# Altium project BatteryBoard.PrjPcb
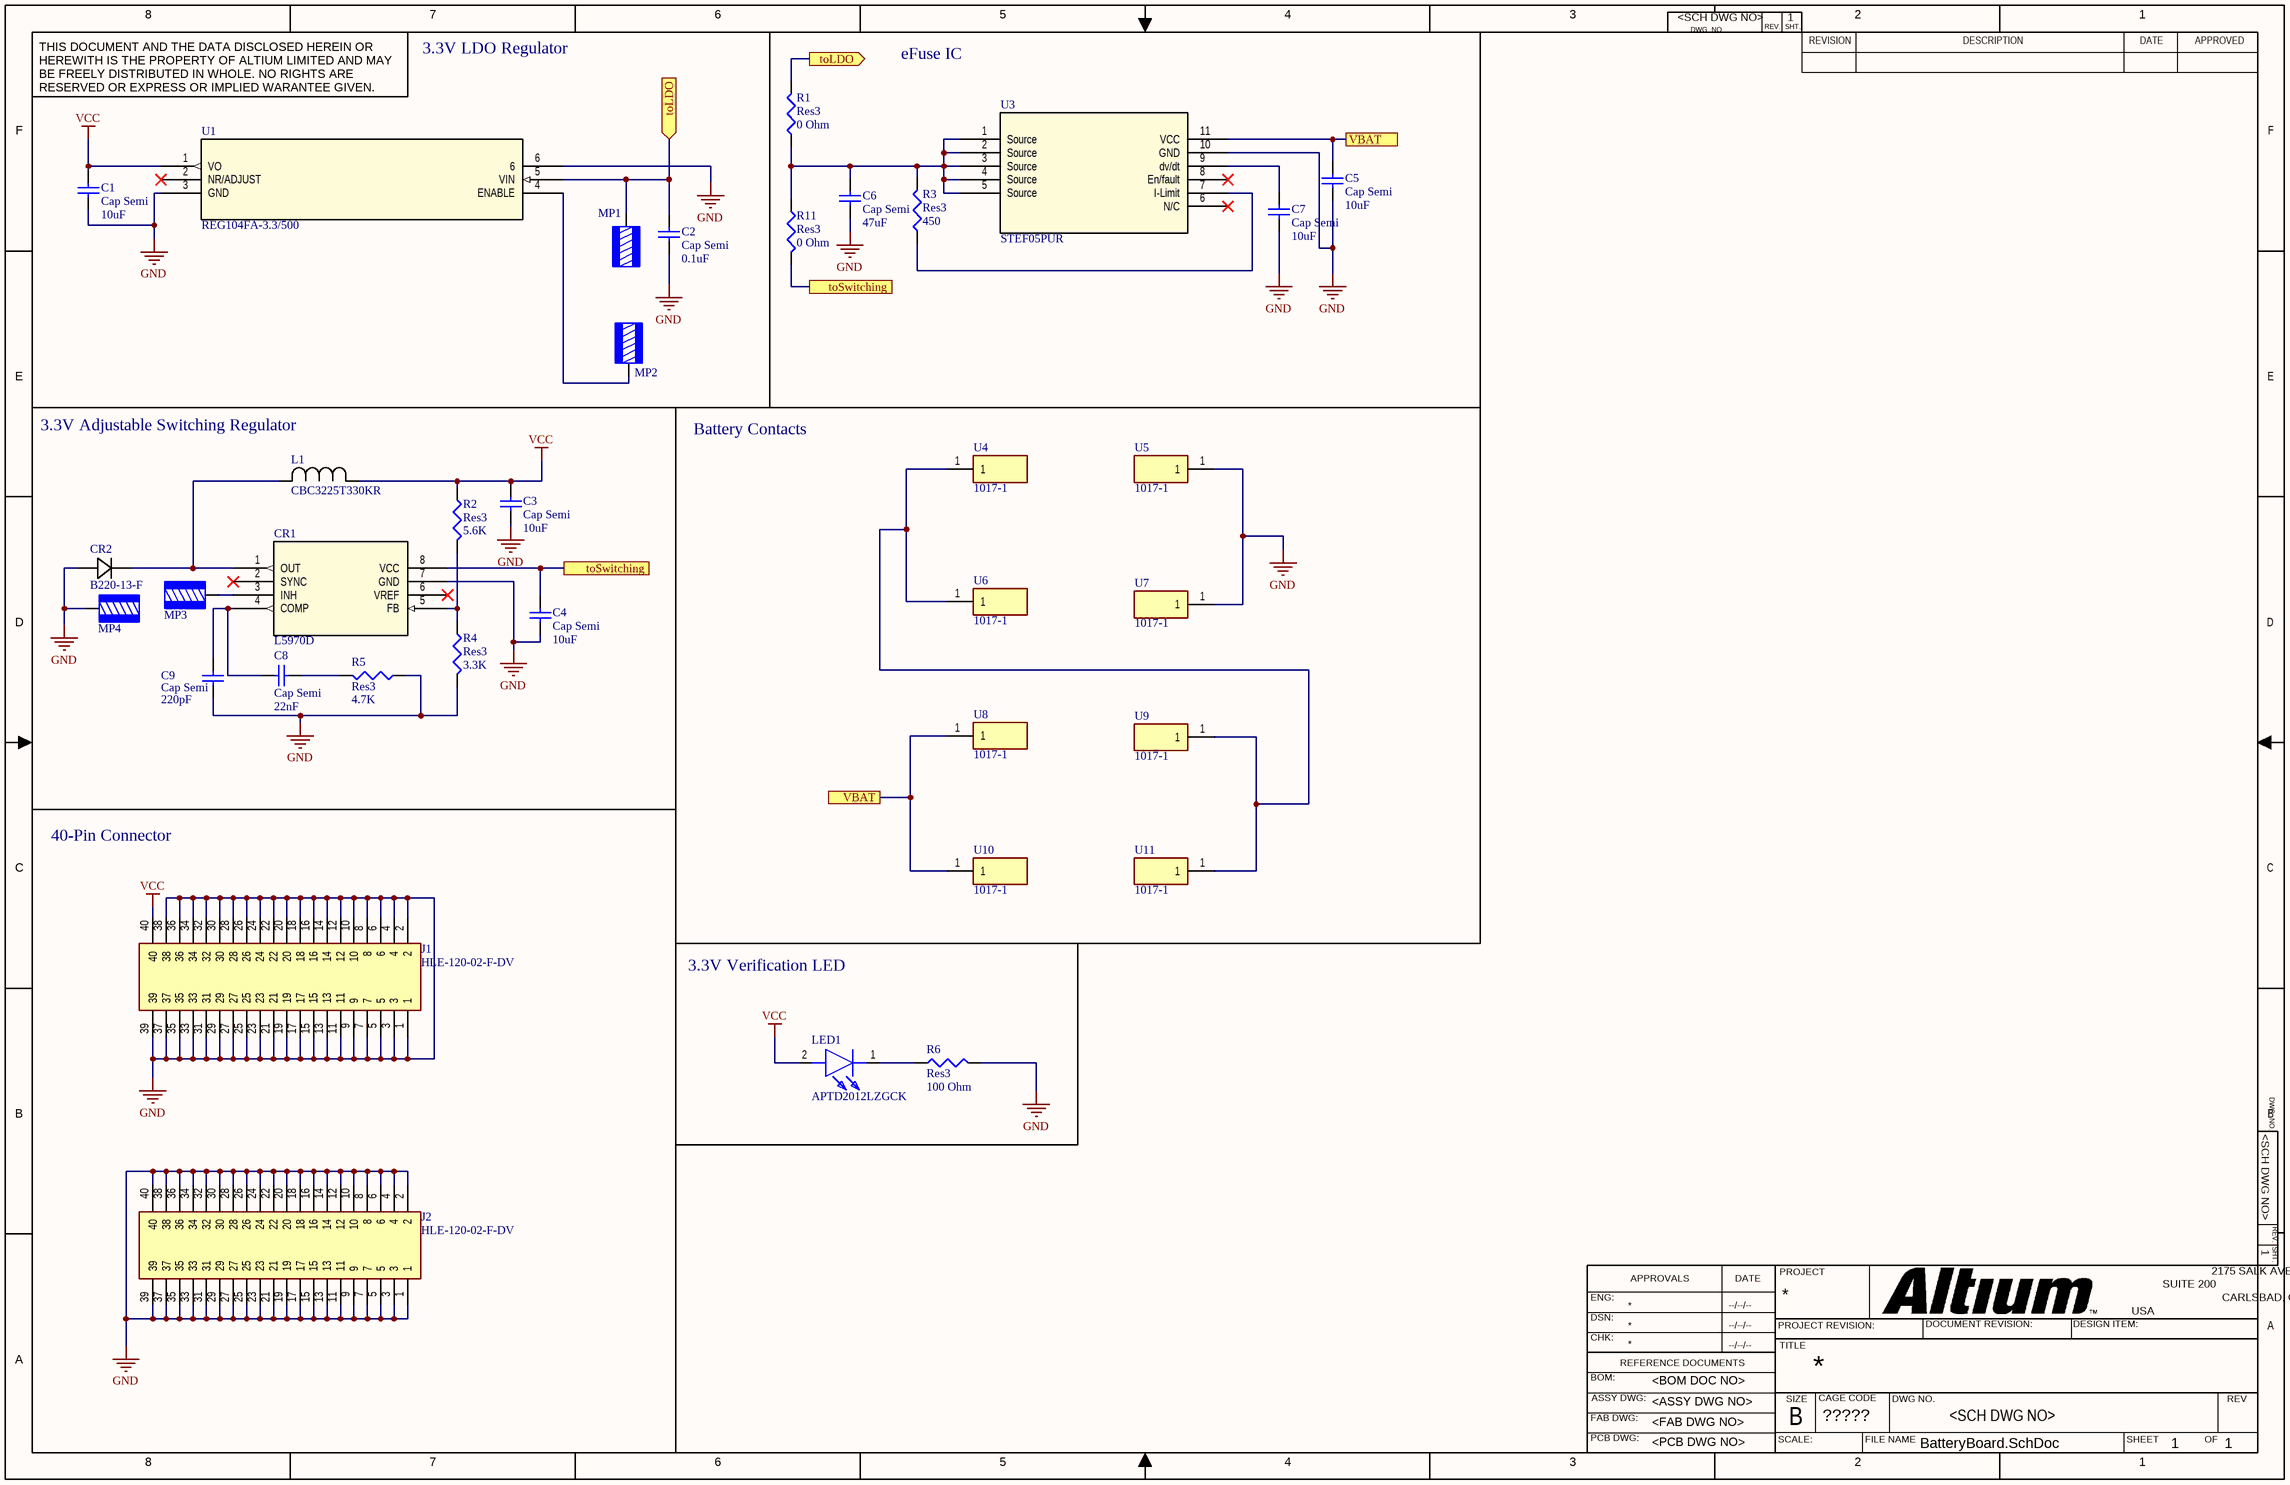
[diagram p0: BatteryBoard.SchDoc]
CAGE_CODE: ?????; CONTRACT_NUMBER: <CONTRACT NO>; DOC_NO_ASSY_DWG: <ASSY DWG NO>; DOC_NO_BOM: <BOM DOC NO>; DOC_NO_FAB_DWG: <FAB DWG NO>; DOC_NO_SCH_DWG: <SCH DWG NO>; PCB_2_DEC_TOL: +/-.01; PCB_3_DEC_TOL: +/-.010; PCB_ANG_TOL: +/-1/2; PCB_ASSEMBLY_NO: <PCB ASSY NO>; PCB_CHECKER: - -----; PCB_CHECKER_APP_DATE: --/--/----; PCB_DESIGNER: - -----; PCB_DESIGNER_APP_DATE: --/--/----; PCB_DWG_NO: <PCB DWG NO>; PCB_ENGINEER: - -----; PCB_ENGINEER_APP_DATE: --/--/----; PCB_PART_NUMBER: <PCB PN>; PCB_REV: A; SCH_REV: A
1 sheet, 36 parts. Net scope: flat (ports and power ports of the same name join across sheets).
Board file: BatteryBoard.PcbDoc

## Sheet BatteryBoard.SchDoc
size 431 x 279 mm; SheetNumber: 1; SheetTotal: 1; ENG_APP_DATE: --/--/--; DSN_APP_DATE: --/--/--; CHK_APP_DATE: --/--/--

### Parts
C1  Cap Semi  value 10uF  [C1206]
C2  Cap Semi  value 0.1uF  [C1206]
C3  Cap Semi  value 10uF  [C1206]
C4  Cap Semi  value 10uF  [C1206]
C5  Cap Semi  value 10uF  [C1206]
C6  Cap Semi  value 47uF  [C1206]
C7  Cap Semi  value 10uF  [C1206]
C8  Cap Semi  value 22nF  [C1206]
C9  Cap Semi  value 220pF  [C1206]
CR1  L5970D  [SO-8_STM-M]
CR2  B220-13-F  [SMB_DIO]
J1  HLE-120-02-F-DV  [SAMTEC_HLE-120-02-F-DV]
J2  HLE-120-02-F-DV  [SAMTEC_HLE-120-02-F-DV]
L1  CBC3225T330KR  [IND_TAIYO_CBC3225_TAY]
LED1  APTD2012LZGCK  [LEDC2012X105N]
MP1  M3  [7466303]  (value not drawn)
MP2  M3  [7466303]  (value not drawn)
MP3  M3  [7466303]  (value not drawn)
MP4  M3  [7466303]  (value not drawn)
R1  Res3  value 0 Ohm  [J1-0603]
R2  Res3  value 5.6K  [J1-0603]
R3  Res3  value 450  [J1-0603]
R4  Res3  value 3.3K  [J1-0603]
R5  Res3  value 4.7K  [J1-0603]
R6  Res3  value 100 Ohm  [J1-0603]
R11  Res3  value 0 Ohm  [J1-0603]
U1  REG104FA-3.3/500  [KTT5_TEX]
U3  STEF05PUR  [DFN_EF05PUR_STM]
U4  1017-1  [10171]
U5  1017-1  [10171]
U6  1017-1  [10171]
U7  1017-1  [10171]
U8  1017-1  [10171]
U9  1017-1  [10171]
U10  1017-1  [10171]
U11  1017-1  [10171]

### Ports
toLDO (in), toLDO (out), toSwitching, VBAT

### Nets
GND: C1.1 C2.1 C3.1 C4.1 C5.2 C6.2 C7.2 C9.1 CR1.7(GND) CR2.2 J1.1 J1.2 J1.3 J1.4 J1.5 J1.6 J1.7 J1.8 J1.9 J1.10 J1.11 J1.12 J1.13 J1.14 J1.15 J1.16 J1.17 J1.18 J1.19 J1.20 J1.21 J1.22 J1.23 J1.24 J1.25 J1.26 J1.27 J1.28 J1.29 J1.30 J1.31 J1.32 J1.33 J1.34 J1.35 J1.36 J1.37 J1.38 J1.39 J2.1 J2.2 J2.3 J2.4 J2.5 J2.6 J2.7 J2.8 J2.9 J2.10 J2.11 J2.12 J2.13 J2.14 J2.15 J2.16 J2.17 J2.18 J2.19 J2.20 J2.21 J2.22 J2.23 J2.24 J2.25 J2.26 J2.27 J2.28 J2.29 J2.30 J2.31 J2.32 J2.33 J2.34 J2.35 J2.36 J2.37 J2.38 J2.39 J2.40 MP4.1 R4.2 R5.1 R6.2 U1.3(GND) U1.6 U3.10(GND) U5.1 U7.1
VCC: C1.2 C3.2 J1.40 L1.1 LED1.2(A) R2.1 U1.1(VO)
NetC2_2: C2.2 MP1.1 R1.2 U1.5(VIN) ; port toLDO
NetC4_2: C4.2 CR1.8(VCC) R11.2 ; port toSwitching
NetC5_1: C5.1 U3.11(VCC) U8.1 U10.1 ; port VBAT
NetC6_1: C6.1 R1.1 R3.2 R11.1 U3.1(Source) U3.2(Source) U3.3(Source) U3.4(Source) U3.5(Source)
NetC7_1: C7.1 U3.9(dv/dt)
NetC8_1: C8.1 R5.2
NetC8_2: C8.2 C9.2 CR1.4(COMP)
NetCR1_1: CR1.1(OUT) CR2.1 L1.2
NetCR1_3: CR1.3(INH) MP3.1
NetCR1_5: CR1.5(FB) R2.2 R4.1
NetLED1_1: LED1.1(K) R6.1
NetMP2_1: MP2.1 U1.4(ENABLE)
NetR3_1: R3.1 U3.7(I-Limit)
NetU4_1: U4.1 U6.1 U9.1 U11.1

Not connected (* = marked no-connect by the designer): CR1 2(SYNC)* 6(VREF)*; U1 2(NR/ADJUST)*; U3 6(N/C)* 8(En/fault)*

### Notes on the sheet
- 3.3V LDO Regulator
- eFuse IC
- (near L1) 3.3V Adjustable Switching Regulator
- Battery Contacts
- 40-Pin Connector
- 3.3V Verification LED
- 8
- 7
- 6
- 5
- 4
- 3
- DWG. NO.
- REV.
- SHT.
- 2
- 1
- THIS DOCUMENT AND THE DATA DISCLOSED HEREIN OR HEREWITH IS THE PROPERTY OF ALTIUM LIMITED AND MAY BE FREELY DISTRIBUTED IN WHOLE. NO RIGHTS ARE RESERVED OR EXPRESS OR IMPLIED WARANTEE GIVEN.
- REVISION
- DESCRIPTION
- DATE
- APPROVED
- F
- E
- D
- C
- B
- ENG:
- APPROVALS
- PROJECT
- SUITE 200
- 2175 SALK AVENUE
- CARLSBAD, CA 92008
- A
- DSN:
- CHK:
- REFERENCE DOCUMENTS
- PROJECT REVISION:
- TITLE
- DOCUMENT REVISION:
- DESIGN ITEM:
- USA
- BOM:
- FAB DWG:
- PCB DWG:
- ASSY DWG:
- SCALE:
- SIZE
- CAGE CODE
- FILE NAME
- DWG NO.
- SHEET
- OF
- REV

### Library data of the parts
C1-C9 = Cap Semi: Capacitor (Semiconductor SIM Model); Published: 8-Jun-2000; LatestRevisionDate: 29-May-2009; LatestRevisionNote: IPC-7351 Footprint Added.; PackageReference: C1206; Publisher: Altium Limited; PackageDescription: Chip Capacitor
CR1 = L5970D: No Description Available; Mfr_Name: STMicroelectronics; Type: DEV; Copyright: Copyright (C) 2022 Ultra Librarian. All rights reserved.; Manufacturer_Part_Number: L5970D; Digi-Key_Part_Number_1: 497-1415-5-ND; RefDes: RefDes
CR2 = B220-13-F: No Description Available; Mfr_Name: Diodes Inc; Type: DEV; Copyright: Copyright (C) 2022 Ultra Librarian. All rights reserved.; Manufacturer_Part_Number: B220-13-F; Digi-Key_Part_Number_1: B220-FDICT-ND; Digi-Key_Part_Number_2: B220-FDIDKR-ND; Digi-Key_Part_Number_3: B220-FDITR-ND; RefDes: RefDes
J1 J2 = HLE-120-02-F-DV: Connector; Manufacturer_Name: SAMTEC; Datasheet Link: http://suddendocs.samtec.com/prints/hle-1xx-02-xxx-dv-xx-xx-xx-mkt.pdf; Manufacturer_Part_Number: HLE-120-02-F-DV; Arrow Part Number: HLE-120-02-F-DV; Arrow Price/Stock: https://www.arrow.com/en/products/hle-120-02-f-dv/samtec
L1 = CBC3225T330KR: No Description Available; Mfr_Name: Taiyo Yuden; Type: DEV; Copyright: Copyright (C) 2022 Ultra Librarian. All rights reserved.; Manufacturer_Part_Number: CBC3225T330KR; Digi-Key_Part_Number_1: 587-3068-1-ND; Digi-Key_Part_Number_2: 587-3068-2-ND; Digi-Key_Part_Number_3: 587-3068-6-ND; RefDes: RefDes
LED1 = APTD2012LZGCK: LED; Manufacturer_Name: Kingbright; Datasheet Link: https://componentsearchengine.com//APTD2012LZGCK.pdf; Height: 1.05mm; Mouser2 Part Number: 604-APTD2012LZGCK; Mouser2 Price/Stock: https://www.mouser.com/Search/Refine.aspx?Keyword=604-APTD2012LZGCK; Manufacturer_Part_Number: APTD2012LZGCK
MP1-MP4 = 7466303: WP-SMRA REDCUBE SMT Right Angled without pins, M3, 50A; Manufacturer: Wurth Elektronik; Surface: Tin; ComponentLink1Description: Website Link; ComponentLink1URL: https://www.we-online.com/redexpert/article/7466303?ad; ComponentLink2Description: Datasheet Link; ComponentLink2URL: https://www.we-online.com/redexpert/spec/7466303?ad; Manufacturer Part Number: 7466303; Category: REDCUBE SMT; Match Code: WP-SMRA; Mount: Surface Mount; Operating Temperature Max: 150°C; Operating Temperature Min: -55°C; Packaging: Bulk; Height: 5mm; Material: Brass; Rated Current: 50A; Thread Size: M3
R1-R6 R11 = Res3: Resistor; Published: 8-Jun-2000; LatestRevisionDate: 29-May-2009; LatestRevisionNote: IPC-7351 Footprint Added.; PackageReference: J1-0603; Publisher: Altium Limited; PackageDescription: Chip Resistor
U1 = REG104FA-3.3/500: No Description Available; Mfr_Name: Texas Instruments; Copyright: Copyright (C) 2022 Ultra Librarian. All rights reserved.; Manufacturer_Part_Number: REG104FA-3.3/500; Digi-Key_Part_Number_1: 2156-REG104FA-3.3/500-ND; Digi-Key_Part_Number_2: 2156-REG104FA-3.3/500-TI-ND; Digi-Key_Part_Number_3: 296-REG104FA-3.3/500CT-ND; Digi-Key_Part_Number_4: 296-REG104FA-3.3/500DKR-ND; Digi-Key_Part_Number_5: 296-REG104FA-3.3/500TR-ND; Digi-Key_Part_Number_6: REG104FA-3.3CT-ND; Digi-Key_Part_Number_7: REG104FA-3.3DKR-ND; Digi-Key_Part_Number_8: REG104FA-3.3TR-ND; RefDes: RefDes; Type: DEV
U3 = STEF05PUR: No Description Available; Mfr_Name: STMicroelectronics; Copyright: Copyright (C) 2022 Ultra Librarian. All rights reserved.; Manufacturer_Part_Number: STEF05PUR; Digi-Key_Part_Number_1: 497-11265-2-ND; Digi-Key_Part_Number_2: 497-11265-1-ND; Digi-Key_Part_Number_3: 497-11265-6-ND; RefDes: RefDes; Type: DEV
U4-U11 = 1017-1: Undefined or Miscellaneous; Manufacturer_Name: Keystone Electronics; Datasheet Link: https://componentsearchengine.com/Datasheets/1/1017-1.pdf; Height: 13.84mm; Manufacturer_Part_Number: 1017-1; Mouser Part Number: 534-1017-1; Mouser Price/Stock: https://www.mouser.co.uk/ProductDetail/Keystone-Electronics/1017-1?qs=wOxb8XianXhq6%252BfB2t0c2Q%3D%3D